# Altium schematic sheet Sheet1.SchDoc
size A3; SheetNumber: 1; SheetTotal: 1
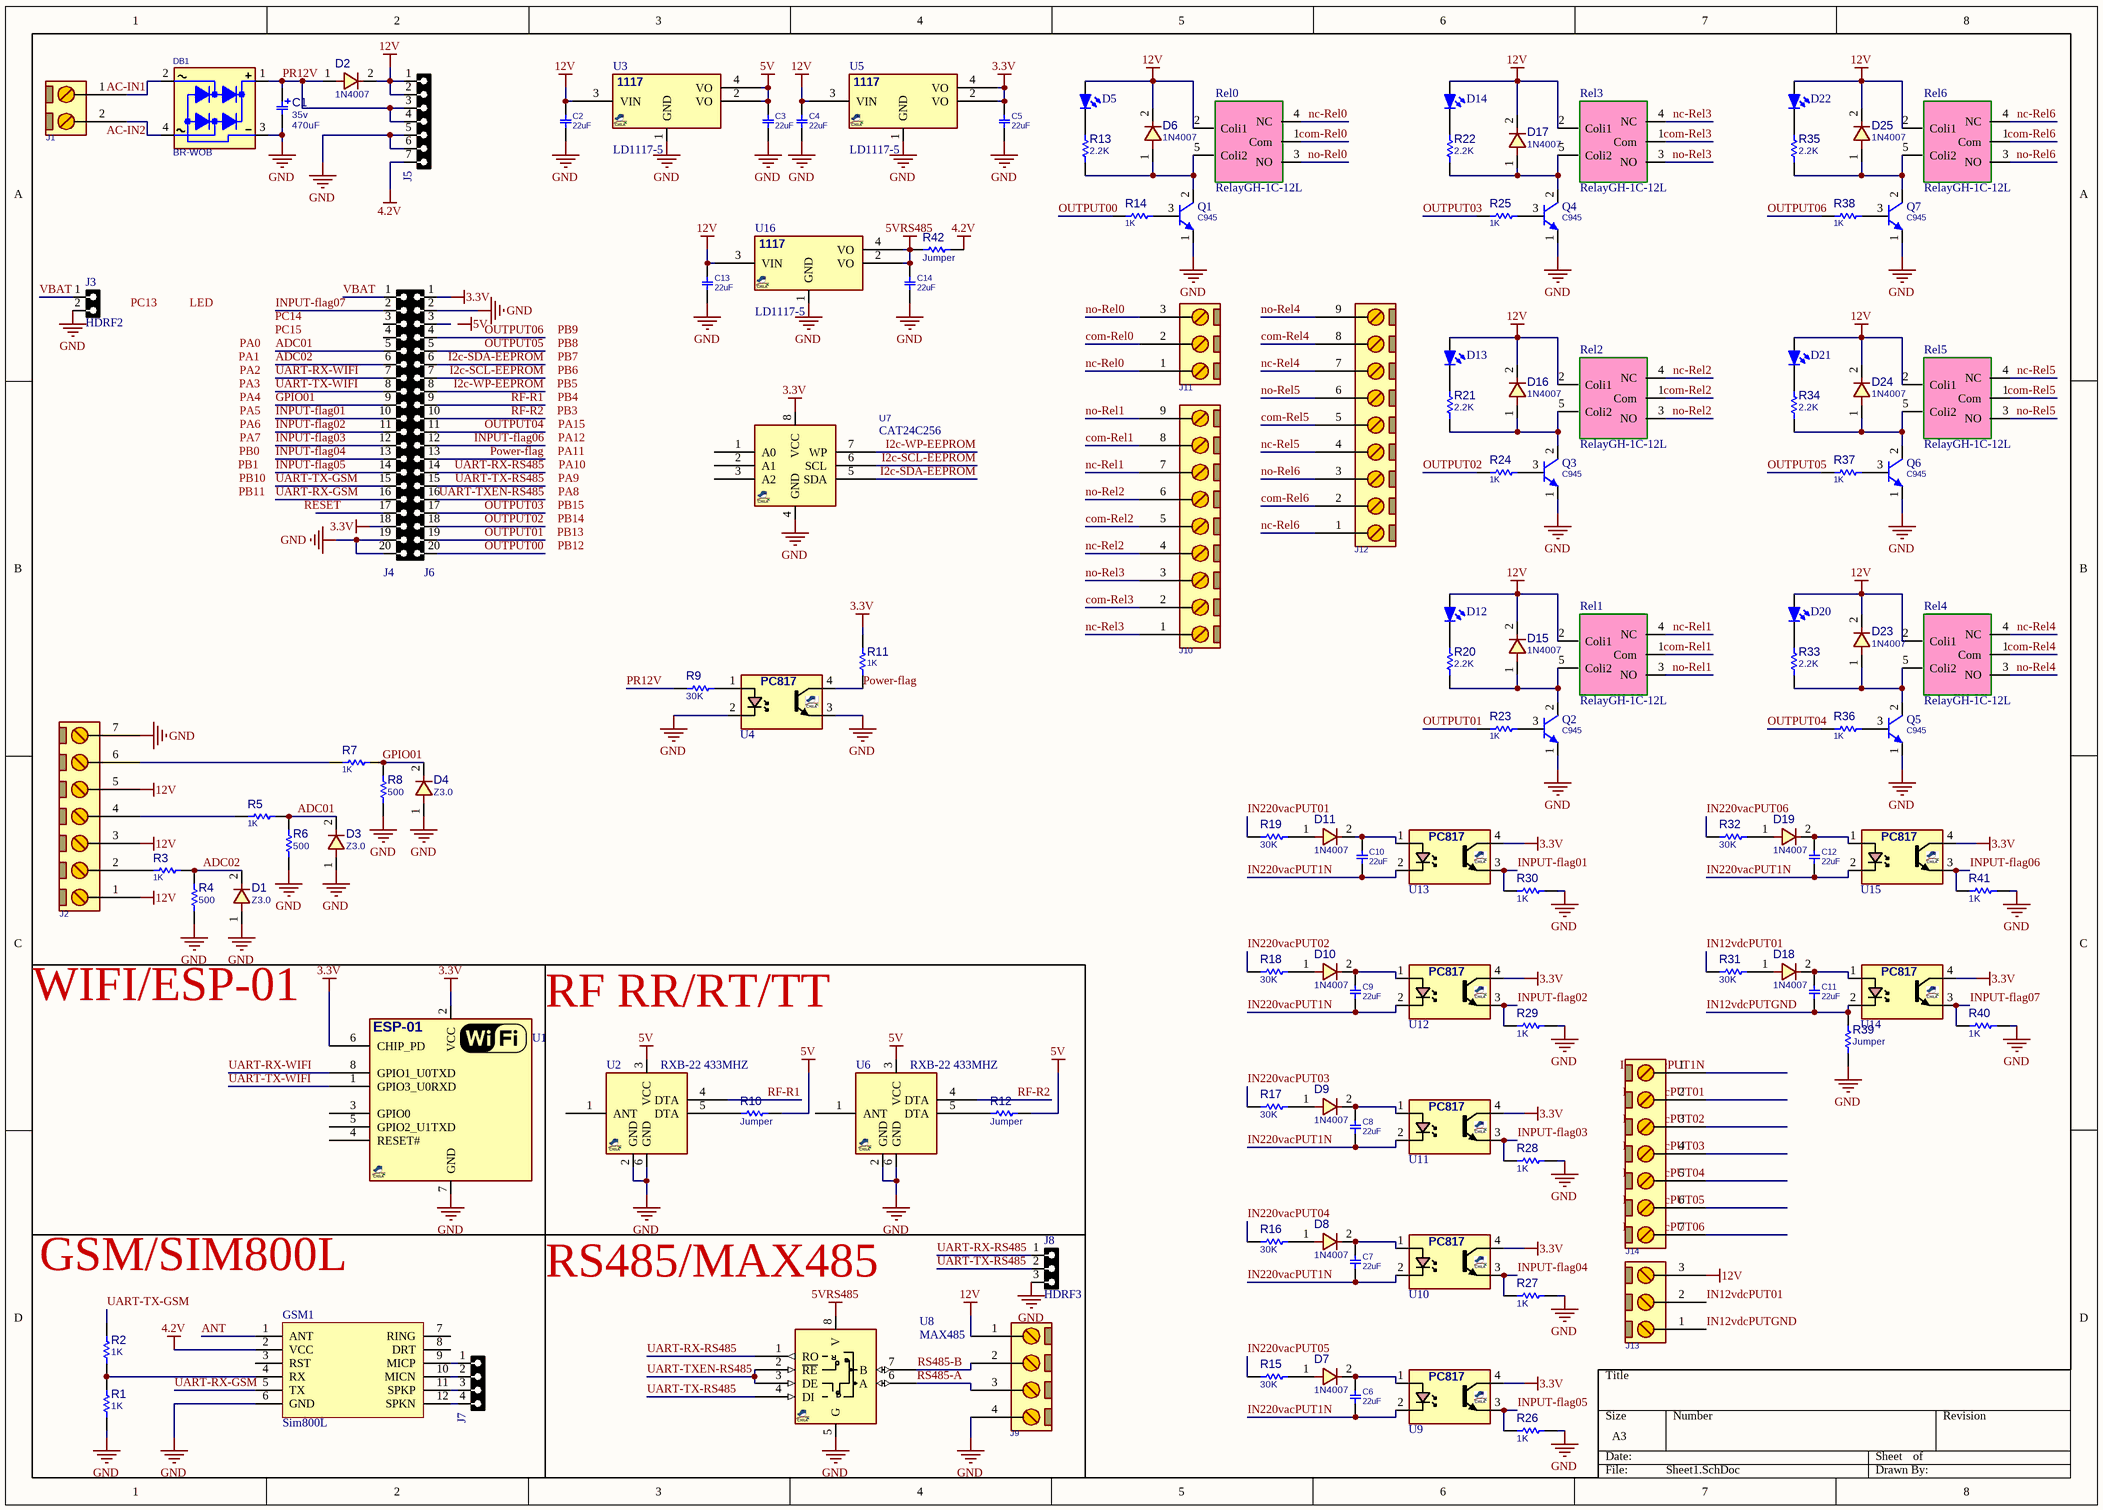
[diagram p0: Sheet1.SchDoc]

## Parts
C1  PARAM2: 35v  [C_EL_10X16]  (hidden comment: 470uF)
C2  22uF  [C0805]
C3  22uF  [C0805]
C4  22uF  [C0805]
C5  22uF  [C0805]
C6  22uF  [C0805]
C7  22uF  [C0805]
C8  22uF  [C0805]
C9  22uF  [C0805]
C10  22uF  [C0805]
C11  22uF  [C0805]
C12  22uF  [C0805]
C13  22uF  [C0805]
C14  22uF  [C0805]
D1  Z3.0  [D_SOD80]
D2  1N4007  [D_SMA]
D3  Z3.0  [D_SOD80]
D4  Z3.0  [D_SOD80]
D5  (no value)  [0805 LED]
D6  1N4007  [D_SMA]
D7  1N4007  [D_SMA]
D8  1N4007  [D_SMA]
D9  1N4007  [D_SMA]
D10  1N4007  [D_SMA]
D11  1N4007  [D_SMA]
D12  (no value)  [0805 LED]
D13  (no value)  [0805 LED]
D14  (no value)  [0805 LED]
D15  1N4007  [D_SMA]
D16  1N4007  [D_SMA]
D17  1N4007  [D_SMA]
D18  1N4007  [D_SMA]
D19  1N4007  [D_SMA]
D20  (no value)  [0805 LED]
D21  (no value)  [0805 LED]
D22  (no value)  [0805 LED]
D23  1N4007  [D_SMA]
D24  1N4007  [D_SMA]
D25  1N4007  [D_SMA]
DB1  BR-WOB  [DBRG_C10]
GSM1  Sim800L  [Sim800L]
J1  CONN_TB2  [MSTB_2]  (value not drawn)
J2  CONN_TB7  [MSTB_7]  (value not drawn)
J3  HDRF2  [HDR_F_1X2]
J4  HDRF20  [HDR_F_1X20]  (value not drawn)
J5  HDRF7  [HDR_F_1X7]  (value not drawn)
J6  HDRF20  [HDR_F_1X20]  (value not drawn)
J7  HDRF4  [HDR_F_1X4]  (value not drawn)
J8  HDRF3  [HDR_F_1X3]
J9  CONN_TB4  [MSTB_4]  (value not drawn)
J10  CONN_TB9  [MSTB_9]  (value not drawn)
J11  CONN_TB3  [MSTB_3]  (value not drawn)
J12  CONN_TB9  [MSTB_9]  (value not drawn)
J13  CONN_TB3  [MSTB_3]  (value not drawn)
J14  CONN_TB7  [MSTB_7]  (value not drawn)
Q1  C945  [TO92_3]
Q2  C945  [TO92_3]
Q3  C945  [TO92_3]
Q4  C945  [TO92_3]
Q5  C945  [TO92_3]
Q6  C945  [TO92_3]
Q7  C945  [TO92_3]
R1  1K  [R0805]
R2  1K  [R0805]
R3  1K  [R025W_AX04]
R4  500  [R0805]
R5  1K  [R025W_AX04]
R6  500  [R0805]
R7  1K  [R025W_AX04]
R8  500  [R0805]
R9  30K  [R0805]
R10  Jumper  [R0805]
R11  1K  [R025W_AX04]
R12  Jumper  [R0805]
R13  2.2K  [R0805]
R14  1K  [R025W_AX04]
R15  30K  [R0805]
R16  30K  [R0805]
R17  30K  [R0805]
R18  30K  [R0805]
R19  30K  [R0805]
R20  2.2K  [R0805]
R21  2.2K  [R0805]
R22  2.2K  [R0805]
R23  1K  [R025W_AX04]
R24  1K  [R025W_AX04]
R25  1K  [R025W_AX04]
R26  1K  [R0805]
R27  1K  [R0805]
R28  1K  [R0805]
R29  1K  [R0805]
R30  1K  [R0805]
R31  30K  [R0805]
R32  30K  [R0805]
R33  2.2K  [R0805]
R34  2.2K  [R0805]
R35  2.2K  [R0805]
R36  1K  [R025W_AX04]
R37  1K  [R025W_AX04]
R38  1K  [R025W_AX04]
R39  Jumper  [R0805]
R40  1K  [R0805]
R41  1K  [R0805]
R42  Jumper  [R0805]
Rel0  RelayGH-1C-12L  [GH-1C-12L]
Rel1  RelayGH-1C-12L  [GH-1C-12L]
Rel2  RelayGH-1C-12L  [GH-1C-12L]
Rel3  RelayGH-1C-12L  [GH-1C-12L]
Rel4  RelayGH-1C-12L  [GH-1C-12L]
Rel5  RelayGH-1C-12L  [GH-1C-12L]
Rel6  RelayGH-1C-12L  [GH-1C-12L]
U1  ESP-01  [ESP8266_ESP01]  (value not drawn)
U2  RXB-22 433MHZ  [RF_ETRXB]
U3  LD1117-5  [SOT223_4]
U4  PC817  [DIP_4]  (value not drawn)
U5  LD1117-5  [SOT223_4]
U6  RXB-22 433MHZ  [RF_ETRXB]
U7  CAT24C256  [SO_8]
U8  MAX485  [DIP_8]
U9  PC817  [DIP_4]  (value not drawn)
U10  PC817  [DIP_4]  (value not drawn)
U11  PC817  [DIP_4]  (value not drawn)
U12  PC817  [DIP_4]  (value not drawn)
U13  PC817  [DIP_4]  (value not drawn)
U14  PC817  [DIP_4]  (value not drawn)
U15  PC817  [DIP_4]  (value not drawn)
U16  LD1117-5  [SOT223_4]

## Nets
3.3V: C5.2 J4.18 J6.1 R11.2 U1.2(VCC) U1.6(CHIP_PD) U5.2(VO) U5.4(VO) U7.8(VCC) U9.4(C) U10.4(C) U11.4(C) U12.4(C) U13.4(C) U14.4(C) U15.4(C)
4.2V: GSM1.2(VCC) J5.7 R42.2
5V: C3.2 R10.2 R12.2 U2.3(VCC) U3.2(VO) U3.4(VO) U6.3(VCC)
5VRS485: C14.2 R42.1 U8.8(V) U16.2(VO) U16.4(VO)
12V: C2.2 C4.2 C13.2 D2.2 D5.1(A) D6.2 D12.1(A) D13.1(A) D14.1(A) D15.2 D16.2 D17.2 D20.1(A) D21.1(A) D22.1(A) D23.2 D24.2 D25.2 J2.1 J2.3 J2.5 J5.1 J5.2 J9.1 J13.3 Rel0.2(Coli1) Rel1.2(Coli1) Rel2.2(Coli1) Rel3.2(Coli1) Rel4.2(Coli1) Rel5.2(Coli1) Rel6.2(Coli1) U3.3(VIN) U5.3(VIN) U16.3(VIN)
GND: C1.2 C2.1 C3.1 C4.1 C5.1 C13.1 C14.1 D1.1 D3.1 D4.1 DB1.3(-DC) GSM1.6(GND) J2.7 J3.2 J4.19 J4.20 J5.5 J5.6 J6.2 J8.3 J9.4 Q1.1(E) Q2.1(E) Q3.1(E) Q4.1(E) Q5.1(E) Q6.1(E) Q7.1(E) R1.2 R4.2 R6.2 R8.2 R26.1 R27.1 R28.1 R29.1 R30.1 R39.2 R40.1 R41.1 U1.7(GND) U2.2(GND) U2.6(GND) U3.1(GND) U4.2(K) U4.3(E) U5.1(GND) U6.2(GND) U6.6(GND) U7.4(GND) U8.5(G) U16.1(GND)
AC-IN1: DB1.2(AC1) J1.1
AC-IN2: DB1.4(AC2) J1.2
ADC01: D3.2 J4.5 R5.2 R6.1
ADC02: D1.2 J4.6 R3.2 R4.1
ANT: GSM1.1(ANT)
com-Rel0: J11.2 Rel0.1(Com)
com-Rel1: J10.8 Rel1.1(Com)
com-Rel2: J10.5 Rel2.1(Com)
com-Rel3: J10.2 Rel3.1(Com)
com-Rel4: J12.8 Rel4.1(Com)
com-Rel5: J12.5 Rel5.1(Com)
com-Rel6: J12.2 Rel6.1(Com)
GPIO01: D4.2 J4.9 R7.2 R8.1
I2c-SCL-EEPROM: J6.7 U7.6(SCL)
I2c-SDA-EEPROM: J6.6 U7.5(SDA)
I2c-WP-EEPROM: J6.8 U7.7(WP)
IN12vdcPUT01: J13.2 R31.1
IN12vdcPUTGND: C11.2 J13.1 R39.1 U14.2(K)
IN220vacPUT01: J14.2 R19.1
IN220vacPUT1N: C6.2 C7.2 C8.2 C9.2 C10.2 C12.2 J14.1 U9.2(K) U10.2(K) U11.2(K) U12.2(K) U13.2(K) U15.2(K)
IN220vacPUT02: J14.3 R18.1
IN220vacPUT03: J14.4 R17.1
IN220vacPUT04: J14.5 R16.1
IN220vacPUT05: J14.6 R15.1
IN220vacPUT06: J14.7 R32.1
INPUT-flag01: J4.10 R30.2 U13.3(E)
INPUT-flag02: J4.11 R29.2 U12.3(E)
INPUT-flag03: J4.12 R28.2 U11.3(E)
INPUT-flag04: J4.13 R27.2 U10.3(E)
INPUT-flag05: J4.14 R26.2 U9.3(E)
INPUT-flag06: J6.12 R41.2 U15.3(E)
INPUT-flag07: J4.2 R40.2 U14.3(E)
nc-Rel0: J11.1 Rel0.4(NC)
nc-Rel1: J10.7 Rel1.4(NC)
nc-Rel2: J10.4 Rel2.4(NC)
nc-Rel3: J10.1 Rel3.4(NC)
nc-Rel4: J12.7 Rel4.4(NC)
nc-Rel5: J12.4 Rel5.4(NC)
nc-Rel6: J12.1 Rel6.4(NC)
no-Rel0: J11.3 Rel0.3(NO)
no-Rel1: J10.9 Rel1.3(NO)
no-Rel2: J10.6 Rel2.3(NO)
no-Rel3: J10.3 Rel3.3(NO)
no-Rel4: J12.9 Rel4.3(NO)
no-Rel5: J12.6 Rel5.3(NO)
no-Rel6: J12.3 Rel6.3(NO)
OUTPUT00: J6.20 R14.1
OUTPUT01: J6.19 R23.1
OUTPUT02: J6.18 R24.1
OUTPUT03: J6.17 R25.1
OUTPUT04: J6.11 R36.1
OUTPUT05: J6.5 R37.1
OUTPUT06: J6.4 R38.1
Power-flag: J6.13 R11.1 U4.4(C)
PR12V: C1.1 D2.1 DB1.1(+DC) J5.3 J5.4 R9.1
RESET: J4.17
RF-R1: J6.9 U2.4(DTA)
RF-R2: J6.10 U6.4(DTA)
RS485-A: J9.3 U8.6(A)
RS485-B: J9.2 U8.7(B)
UART-RX-GSM: GSM1.5(TX) J4.16
UART-RX-RS485: J6.14 J8.1 U8.1(RO)
UART-RX-WIFI: J4.7 U1.8(GPIO1_U0TXD)
UART-TX-GSM: J4.15 R2.1
UART-TX-RS485: J6.15 J8.2 U8.4(DI)
UART-TX-WIFI: J4.8 U1.1(GPIO3_U0RXD)
UART-TXEN-RS485: J6.16 U8.2(~{RE}) U8.3(DE)
VBAT: J3.1 J4.1
NetC6_1: C6.1 D7.2 U9.1(A)
NetC7_1: C7.1 D8.2 U10.1(A)
NetC8_1: C8.1 D9.2 U11.1(A)
NetC9_1: C9.1 D10.2 U12.1(A)
NetC10_1: C10.1 D11.2 U13.1(A)
NetC11_1: C11.1 D18.2 U14.1(A)
NetC12_1: C12.1 D19.2 U15.1(A)
NetD5_2: D5.2(K) R13.2
NetD6_1: D6.1 Q1.2(C) R13.1 Rel0.5(Coli2)
NetD7_1: D7.1 R15.2
NetD8_1: D8.1 R16.2
NetD9_1: D9.1 R17.2
NetD10_1: D10.1 R18.2
NetD11_1: D11.1 R19.2
NetD12_2: D12.2(K) R20.2
NetD13_2: D13.2(K) R21.2
NetD14_2: D14.2(K) R22.2
NetD15_1: D15.1 Q2.2(C) R20.1 Rel1.5(Coli2)
NetD16_1: D16.1 Q3.2(C) R21.1 Rel2.5(Coli2)
NetD17_1: D17.1 Q4.2(C) R22.1 Rel3.5(Coli2)
NetD18_1: D18.1 R31.2
NetD19_1: D19.1 R32.2
NetD20_2: D20.2(K) R33.2
NetD21_2: D21.2(K) R34.2
NetD22_2: D22.2(K) R35.2
NetD23_1: D23.1 Q5.2(C) R33.1 Rel4.5(Coli2)
NetD24_1: D24.1 Q6.2(C) R34.1 Rel5.5(Coli2)
NetD25_1: D25.1 Q7.2(C) R35.1 Rel6.5(Coli2)
NetGSM1_4: GSM1.4(RX) R1.1 R2.2
NetGSM1_9: GSM1.9(MICP) J7.1
NetGSM1_10: GSM1.10(MICN) J7.2
NetGSM1_11: GSM1.11(SPKP) J7.3
NetGSM1_12: GSM1.12(SPKN) J7.4
NetJ2_2: J2.2 R3.1
NetJ2_4: J2.4 R5.1
NetJ2_6: J2.6 R7.1
NetQ1_3: Q1.3(B) R14.2
NetQ2_3: Q2.3(B) R23.2
NetQ3_3: Q3.3(B) R24.2
NetQ4_3: Q4.3(B) R25.2
NetQ5_3: Q5.3(B) R36.2
NetQ6_3: Q6.3(B) R37.2
NetQ7_3: Q7.3(B) R38.2
NetR9_2: R9.2 U4.1(A)
NetR10_1: R10.1 U2.5(DTA)
NetR12_1: R12.1 U6.5(DTA)

Not connected (* = marked no-connect by the designer): GSM1 3(RST) 7(RING) 8(DRT); J4 3 4; J6 3; U1 3(GPIO0) 4(RESET#) 5(GPIO2_U1TXD); U2 1(ANT); U6 1(ANT); U7 1(A0) 2(A1) 3(A2)

## Notes on the sheet
- WIFI/ESP-01
- RF RR/RT/TT
- GSM/SIM800L
- (near U8) RS485/MAX485
- Labels drawn without touching a wire or pin: 5V, LED, PA0, PA1, PA2, PA3, PA4, PA5, PA6, PA7, PA8, PA9, PA10, PA11, PA12, PA15, PB0, PB1, PB3, PB4, PB5, PB6, PB7, PB8, PB9, PB10, PB11, PB12, PB13, PB14, PB15, PC13, PC14, PC15
- (in symbol MAX485_DIP8) R; D
- (in symbol VREG_1117_SOT223) 1117

## Library data of the parts
C1 = CAP_THD_EL_470uF_35v: CAP, THD, ELEC,; MANF_P#: MANF_PART#; DESC: DESCRIPTION; DIST#: MOUSER; PARAM: 20%; PRICE: 10= -$; MANF: MANF; ASSEMBLY: ASSEMBLY; VALUE: 470uF
C2-C14 = CAP_SMD_MLCC_10u25V: CAP, MLCC, X5R 10uF 10% 25V 0805; PARAM: X5R, 10%; MANF_P#: TMK212BBJ106MG; MANF: Taiyo Yuden; PARAM2: 25V; PRICE: 100=6$; VALUE: 22uF
D1 D3 D4 = DIODE_SMD_1N4148_SOD80: DIODE, FAST SWTICHING, 0.3A, 0.5W; DESC: DESCRIPTION; PARAM: 75V; PARAM2: 300mA, 0.5W; MANF_P#: 1N4148; MANF: MANF; ASSEMBLY: ASSEMBLY; PRICE: PRICE; VALUE: Z3.0
D2 D6-D11 D15-D19 D23-D25 = DIODE_SMD_1N4007: DIODE, GENERAL PURPOSE, 1000V/1A; MANF: Kingtronics; DESC: DESCRIPTION; PARAM: 1000V VRRM; PARAM2: 1A; MANF_P#: M7; ASSEMBLY: ASSEMBLY; PRICE: PRICE; VALUE: 1N4007
D5 D12-D14 D20-D22 = LED: Published: 8-Jun-2000; LatestRevisionDate: 08-Jul-2005; LatestRevisionNote: Mech Layer 1 removed.; PackageReference: LED-0; Publisher: Altium Limited
DB1 = DIODE_THD_BRIDGE_WO: DIODE, BRIDGE,; VALUE: BR-WOB
J1 = CONN_MSTB_2: CONN, PHOENIX MSTB, 5-G, 5.08mm pitch; PARAM2: 320V; PARAM: 12A; VALUE: CONN_TB2
J2 J14 = CONN_MSTB_7: CONN, PHOENIX MSTB, 5-G, 5.08mm pitch; PARAM2: 320V; PARAM: 12A; VALUE: CONN_TB7
J3 = HDR_F_1X2: CONN, HEADER, Female, pitch: 2.54mm, 2POS; VALUE: HDRF2
J4 J6 = HDR_F_1X20: CONN, HEADER, Female, pitch: 2.54mm, 20POS; VALUE: HDRF20
J5 = HDR_F_1X7: CONN, HEADER, Female, pitch: 2.54mm, 7POS; VALUE: HDRF7
J7 = HDR_F_1X4: CONN, HEADER, Female, pitch: 2.54mm, 4POS; VALUE: HDRF4
J8 = HDR_F_1X3: CONN, HEADER, Female, pitch: 2.54mm, 3POS; VALUE: HDRF3
J9 = CONN_MSTB_4: CONN, PHOENIX MSTB, 5-G, 5.08mm pitch; PARAM2: 320V; PARAM: 12A; VALUE: CONN_TB4
J10 J12 = CONN_MSTB_9: CONN, PHOENIX MSTB, 5-G, 5.08mm pitch; PARAM2: 320V; PARAM: 12A; VALUE: CONN_TB9
J11 J13 = CONN_MSTB_3: CONN, PHOENIX MSTB, 5-G, 5.08mm pitch; PARAM2: 320V; PARAM: 12A; VALUE: CONN_TB3
Q1-Q7 = NPN_C945_TO92: BJT, NPN, 50v, 0.15A, THD, TO92, BC945; PARAM2: 250mW; MANF_P#: C945, 2SC945, BC945; PARAM: 50v, 0.15A; MANF: -; VALUE: C945
R1 R2 R4 R6 R8 R10 R12 R19 R42 = RES_SMD_0805: RESISTOR, SMD; PARAM: -W; DESC: DESCRIPTION; DIST#: MOUSER; PARAM2: 1%; MANF_P#: -; MANF: -; ASSEMBLY: ASSEMBLY; PRICE: 100= 0.5$
  R1 R2: VALUE: 1K
  R4 R6 R8: VALUE: 500
  R10 R12 R42: VALUE: Jumper
  R19: VALUE: 30K
R3 R5 R7 R11 R14 R23-R25 R36-R38 = RES_THD: RESISTOR, THD; MANF_P#: RK73H1ETTP4701F; MANF: KOA SPEER; PARAM: 0.063W; DESC: DESCRIPTION; DIST#: MOUSER; PARAM2: 1%; ASSEMBLY: ASSEMBLY; PRICE: 100= 0.5$; VALUE: 1K
R9 R13 R15-R18 R20-R22 R26-R35 R39-R41 = RES_SMD: RESISTOR, SMD; PARAM: -W; DESC: DESCRIPTION; DIST#: MOUSER; PARAM2: 1%; MANF_P#: -; MANF: -; ASSEMBLY: ASSEMBLY; PRICE: 100= 0.5$
  R9 R15-R18 R31 R32: VALUE: 30K
  R13 R20-R22 R33-R35: VALUE: 2.2K
  R26-R30 R40 R41: VALUE: 1K
  R39: VALUE: Jumper
Rel0-Rel6 = RelayGH-1C-12L: HJR-3FF-12VDC-S-Z
U1 = ESP8266_ESP-01: ESP8266 ESP-01 WiFi Module; MANF_P#: ESP-01; VALUE: ESP-01
U2 U6 = ET-RXB-22: Modules RF 433MHz; PARAM2: 3.3~5.5VCC; PARAM: 433MHz, 2.4Kbps, -30~85oC; MANF: www.eeant.com; MANF_P#: ET-RXB-22; PRICE: 7t@ECA; VALUE: RXB-22 433MHZ
U3 U5 U16 = VREG_1117_SOT223: REG, Linear, LDO1V, 0.8A, SOT-223; MANF_P#: LD1117, LM1117, AMS1117, TLV1117, REG1117, NCP1117, LT1117, SPX1117; MANF: TI, ON, ST; PARAM2: 1.2/1.5/1.8/2.5/2.85/3.3/5V; PARAM: LDO1V, 0.8A; VALUE: LD1117-5
U4 U9-U15 = OPTC_TR4P_PC817: OPTOCOUPLER, TRANSISTOR, 4PIN; PARAM: IF=20mA; PARAM2: VCE = 35V; MANF: SHARP; MANF_P#: PC817; PRICE: -; VALUE: PC817
U7 = EEPROM_I2C_CAT24C256_SOP8: EEPROM, I2C, 256Kb,  SOP-8; MANF: ON; MANF_P#: CAT24C256W; VALUE: CAT24C256
U8 = MAX485_DIP8: RS-485 Transceiver, 5V, DIP-8, ±7V Ground Difference Between Devices on the Bus; MANF_P#: MAX485EPA; MANF: Maxim Integrated; PRICE: 700toman@PAYA; VALUE: MAX485